# Altium schematic sheet Sheet1.SchDoc
size A; SheetNumber: 5; SheetTotal: 6
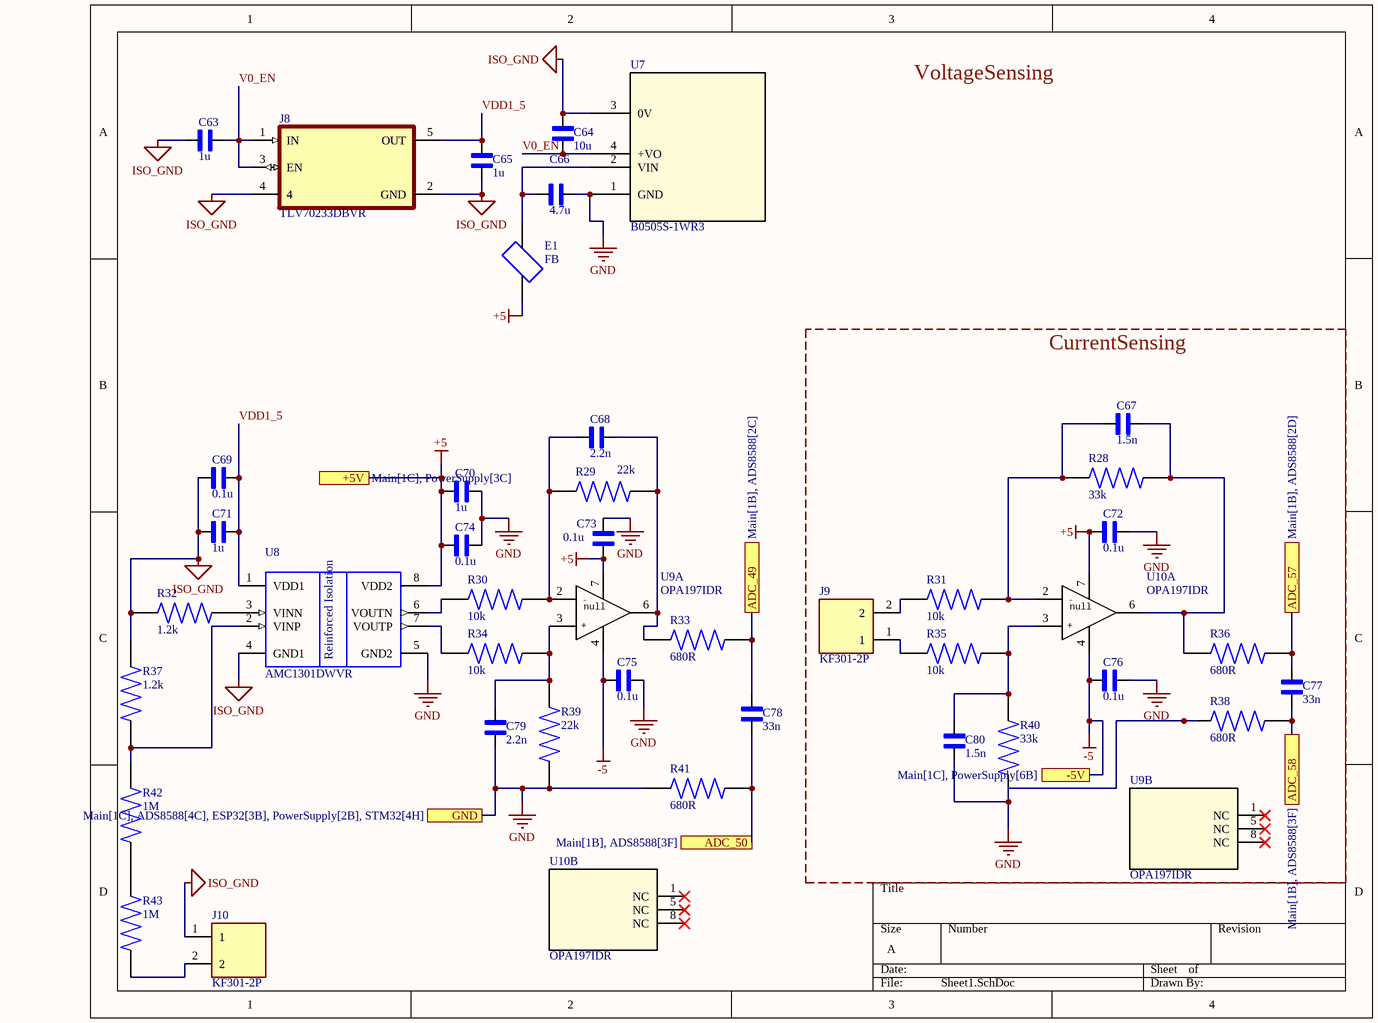
[diagram p0: Sheet1.SchDoc]

## Parts
C63  1u  [0603Capacitor]
C64  10u  [0603Capacitor]
C65  1u  [0603Capacitor]
C66  4.7u  [0603Capacitor]
C67  1.5n  [0603Capacitor]
C68  2.2n  [0603Capacitor]
C69  0.1u  [0603Capacitor]
C70  1u  [0603Capacitor]
C71  1u  [0603Capacitor]
C72  0.1u  [0603Capacitor]
C73  0.1u  [0603Capacitor]
C74  0.1u  [0603Capacitor]
C75  0.1u  [0603Capacitor]
C76  0.1u  [0603Capacitor]
C77  33n  [CAPC1206]
C78  33n  [CAPC1206]
C79  2.2n  [0603Capacitor]
C80  1.5n  [0603Capacitor]
E1  FB  [FB_MI1206K601R-10]
J8  TLV70233DBVR  [TLV70233]
J9  KF301-2P  [HANDSON_KF301-2P]
J10  KF301-2P  [HANDSON_KF301-2P]
R28  33k  [0603Resistor]
R29  22k  [0603Resistor]
R30  10k  [0603Resistor]
R31  10k  [0603Resistor]
R32  1.2k  [0603Resistor]
R33  680R  [0603Resistor]
R34  10k  [0603Resistor]
R35  10k  [0603Resistor]
R36  680R  [0603Resistor]
R37  1.2k  [0603Resistor]
R38  680R  [0603Resistor]
R39  22k  [0603Resistor]
R40  33k  [0603Resistor]
R41  680R  [0603Resistor]
R42  1M  [1M_1206]
R43  1M  [1M_1206]
U7  B0505S-1WR3  [B0505S]
U8  AMC1301DWVR  [AMC1301]
U9  OPA197IDR  [D0008A-MFG]  (parts A,B of 2)
U10  OPA197IDR  [D0008A-MFG]  (parts A,B of 2)

## Blocks framed on the sheet
CurrentSensing: C67 C72 C76 C77 C80 J9 R28 R31 R35 R36 R38 R40 U9 U10

## Ports
+5V (see Main[1C], PowerSupply[3C]), -5V (see Main[1C], PowerSupply[6B]), ADC_49 (see Main[1B], ADS8588[2C]), ADC_50 (see Main[1B], ADS8588[3F]), ADC_57 (see Main[1B], ADS8588[2D]), ADC_58 (see Main[1B], ADS8588[3F]), GND (see Main[1C], ADS8588[4C], ESP32[3B], PowerSupply[2B], STM32[4H])

## Nets
+5: C70.1 C72.1 C73.1 C74.1 E1.1 U8.8(VDD2) U9.7(V+) U10.7(V+) ; port +5V
-5: C75.1 C76.1 U9.4(V-) U10.4(V-) ; port -5V
GND: C66.2 C70.2 C72.2 C73.2 C74.2 C75.2 C76.2 C79.1 C80.1 R38.1 R39.1 R40.1 R41.1 U7.1(GND) U8.5(GND2) ; port GND
ISO_GND: C63.1 C64.2 C65.1 C69.1 C71.1 J8.2(GND) J8.4 J10.1 R32.1 R37.2 U7.3(0V) U8.4(GND1)
ADC_49: C78.2 R33.2 ; port ADC_49
ADC_50: C78.1 R41.2 ; port ADC_50
ADC_57: C77.2 R36.2 ; port ADC_57
ADC_58: C77.1 R38.2 ; port ADC_58
V0_EN: C63.2 C64.1 J8.1(IN) J8.3(EN) U7.4(+VO)
VDD1_5: C65.2 C69.2 C71.2 J8.5(OUT) U8.1(VDD1)
NetC66_1: C66.1 E1.2 U7.2(VIN)
NetC67_1: C67.1 R28.1 R31.2 U10.2(-IN)
NetC67_2: C67.2 R28.2 R36.1 U10.6(OUT)
NetC68_1: C68.1 R29.1 R30.2 U9.2(-IN)
NetC68_2: C68.2 R29.2 R33.1 U9.6(OUT)
NetC79_2: C79.2 R34.2 R39.2 U9.3(+IN)
NetC80_2: C80.2 R35.2 R40.2 U10.3(+IN)
NetJ9_1: J9.1 R35.1
NetJ9_2: J9.2 R31.1
NetJ10_2: J10.2 R43.1
NetR30_1: R30.1 U8.6(VOUTN)
NetR32_2: R32.2 U8.3(VINN)
NetR34_1: R34.1 U8.7(VOUTP)
NetR37_1: R37.1 R42.2 U8.2(VINP)
NetR42_1: R42.1 R43.2

Not connected (* = marked no-connect by the designer): U9 1(NC)* 5(NC)* 8(NC)*; U10 1(NC)* 5(NC)* 8(NC)*

## Notes on the sheet
- VoltageSensing
- (in symbol AMC1301DWVR) Reinforced Isolation
- (in symbol OPA197IDR, part A) -; null; +

## Library data of the parts
C63 C65 C70 C71 = 0603_1u: 1uF,X7R,50V; MF: AVX; MP: 0603YC223KAT2A; SnapEDA_Link: https://www.snapeda.com/parts/0603YC223KAT2A/AVX/view-part/?ref=snap; Package: 1608 AVX; Value: *; Check_prices: https://www.snapeda.com/parts/0603YC223KAT2A/AVX/view-part/?ref=eda
C64 = 0603_10u: 10uF,X7R,50V; MF: AVX; MP: 0603YC223KAT2A; SnapEDA_Link: https://www.snapeda.com/parts/0603YC223KAT2A/AVX/view-part/?ref=snap; Package: 1608 AVX; Value: *; Check_prices: https://www.snapeda.com/parts/0603YC223KAT2A/AVX/view-part/?ref=eda
C66 = 0603_4.7u: 4.7uF,X7R,50V; MF: AVX; MP: 0603YC223KAT2A; SnapEDA_Link: https://www.snapeda.com/parts/0603YC223KAT2A/AVX/view-part/?ref=snap; Package: 1608 AVX; Value: *; Check_prices: https://www.snapeda.com/parts/0603YC223KAT2A/AVX/view-part/?ref=eda
C67 C80 = 0603_1.5nf: 1.5nf_C0G_50V; MF: AVX; MP: 0603YC223KAT2A; SnapEDA_Link: https://www.snapeda.com/parts/0603YC223KAT2A/AVX/view-part/?ref=snap; Package: 1608 AVX; Value: *; Check_prices: https://www.snapeda.com/parts/0603YC223KAT2A/AVX/view-part/?ref=eda
C68 C79 = 0603_2.2n: 2.2nF,C0G,50V; MF: AVX; MP: 0603YC223KAT2A; SnapEDA_Link: https://www.snapeda.com/parts/0603YC223KAT2A/AVX/view-part/?ref=snap; Package: 1608 AVX; Value: *; Check_prices: https://www.snapeda.com/parts/0603YC223KAT2A/AVX/view-part/?ref=eda
C69 C72-C76 = 0603_0.1u: 100nf,X7R,50V; MF: AVX; MP: 0603YC223KAT2A; SnapEDA_Link: https://www.snapeda.com/parts/0603YC223KAT2A/AVX/view-part/?ref=snap; Package: 1608 AVX; Value: *; Check_prices: https://www.snapeda.com/parts/0603YC223KAT2A/AVX/view-part/?ref=eda
C77 C78 = 0603_33n: 33nf_C0G_50V; MF: AVX; MP: 0603YC223KAT2A; SnapEDA_Link: https://www.snapeda.com/parts/0603YC223KAT2A/AVX/view-part/?ref=snap; Package: 1608 AVX; Value: *; Check_prices: https://www.snapeda.com/parts/0603YC223KAT2A/AVX/view-part/?ref=eda
E1 = MI1206K601R-10: 600 Ohms @ 100 MHz 1 Power, Signal Line Ferrite Bead 1206 (3216 Metric) 1.5A 80mOhm; MF: Laird-Signal Integrity; SnapEDA_Link: https://www.snapeda.com/parts/MI1206K601R-10/Laird-Signal+Integrity+Products/view-part/?ref=snap; Package: 1206 Laird; Value: *; MP: MI1206K601R-10; Check_prices: https://www.snapeda.com/parts/MI1206K601R-10/Laird-Signal+Integrity+Products/view-part/?ref=eda
J8 = TLV70233DBVR: 300-mA, high-PSRR, low-IQ, low-dropout voltage regulator with enable; MF: Texas Instruments; SnapEDA_Link: https://www.snapeda.com/parts/TLV70233DBVR/Texas+Instruments/view-part/?ref=snap; Package: SOT-23-5 Texas Instruments; Value: *; MP: TLV70233DBVR; Check_prices: https://www.snapeda.com/parts/TLV70233DBVR/Texas+Instruments/view-part/?ref=eda
J9 J10 = KF301-2P: 2 Pin Terminal Block 5mm Pitch; MF: Handson Technology; SnapEDA_Link: https://www.snapeda.com/parts/KF301-2P/Handson+Technology/view-part/?ref=snap; Package: None; Value: *; MP: KF301-2P; Check_prices: https://www.snapeda.com/parts/KF301-2P/Handson+Technology/view-part/?ref=eda
R28 R40 = 0603_33k_1: 33kOhm; MF: Bourns; MP: CRT0603-FY-1000ELF; Purchase-URL: https://pricing.snapeda.com/search/part/CRT0603-FY-1000ELF/?ref=eda; Value: *; SnapEDA_Link: https://www.snapeda.com/parts/CRT0603-FY-1000ELF/Bourns/view-part/?ref=snap; Package: 1508 Bourns; Check_prices: https://www.snapeda.com/parts/CRT0603-FY-1000ELF/Bourns/view-part/?ref=eda; Digi-Key_Part_Number: 118-CRT0603-FY-1000ELFTR-ND
R29 R39 = 0603_22k: 22kOhm_0.1% to 0.5%; MF: Bourns; MP: CRT0603-FY-1000ELF; Purchase-URL: https://pricing.snapeda.com/search/part/CRT0603-FY-1000ELF/?ref=eda; Value: *; SnapEDA_Link: https://www.snapeda.com/parts/CRT0603-FY-1000ELF/Bourns/view-part/?ref=snap; Package: 1508 Bourns; Check_prices: https://www.snapeda.com/parts/CRT0603-FY-1000ELF/Bourns/view-part/?ref=eda; Digi-Key_Part_Number: 118-CRT0603-FY-1000ELFTR-ND
R30 R31 R34 R35 = 0603_10k: 10kOhm; MF: Bourns; MP: CRT0603-FY-1000ELF; Purchase-URL: https://pricing.snapeda.com/search/part/CRT0603-FY-1000ELF/?ref=eda; Value: *; SnapEDA_Link: https://www.snapeda.com/parts/CRT0603-FY-1000ELF/Bourns/view-part/?ref=snap; Package: 1508 Bourns; Check_prices: https://www.snapeda.com/parts/CRT0603-FY-1000ELF/Bourns/view-part/?ref=eda; Digi-Key_Part_Number: 118-CRT0603-FY-1000ELFTR-ND
R32 R37 = 0603_1.2K: 1.2k (0.1%-0.5%); MF: Bourns; MP: CRT0603-FY-1000ELF; Purchase-URL: https://pricing.snapeda.com/search/part/CRT0603-FY-1000ELF/?ref=eda; Value: *; SnapEDA_Link: https://www.snapeda.com/parts/CRT0603-FY-1000ELF/Bourns/view-part/?ref=snap; Package: 1508 Bourns; Check_prices: https://www.snapeda.com/parts/CRT0603-FY-1000ELF/Bourns/view-part/?ref=eda; Digi-Key_Part_Number: 118-CRT0603-FY-1000ELFTR-ND
R33 R36 R38 R41 = 0603_680Ohm: 680Ohm-0.1%; MF: Bourns; MP: CRT0603-FY-1000ELF; Purchase-URL: https://pricing.snapeda.com/search/part/CRT0603-FY-1000ELF/?ref=eda; Value: *; SnapEDA_Link: https://www.snapeda.com/parts/CRT0603-FY-1000ELF/Bourns/view-part/?ref=snap; Package: 1508 Bourns; Check_prices: https://www.snapeda.com/parts/CRT0603-FY-1000ELF/Bourns/view-part/?ref=eda; Digi-Key_Part_Number: 118-CRT0603-FY-1000ELFTR-ND
R42 R43 = 1206-1M: 1M Ohms Â±1% 0.25W, 1/4W Chip Resistor 1206 (3216 Metric) Moisture Resistant Thick Film; MF: Yageo; MP: RC1206JR-0713RL; SnapEDA_Link: https://www.snapeda.com/parts/RC1206JR-0713RL/Yageo/view-part/?ref=snap; Package: 3116 Yageo; Value: *; Check_prices: https://www.snapeda.com/parts/RC1206JR-0713RL/Yageo/view-part/?ref=eda
U7 = B0505S-1WR3: Description; Manufacturer_Name: MORNSUN; Type: DC DC Converters; Copyright: Copyright (C) 2026 Ultra Librarian. All rights reserved.; Manufacturer_Part_Number: B0505S-1WR3; RefDes: RefDes
U8 = AMC1301DWVR: 250 mV-Input Precision Reinforced Isolated Amplifier for Current Sensing 8-SOIC -40 to 125; MF: Texas Instruments; Check_prices: https://www.snapeda.com/parts/AMC1301DWVR/Texas+Instruments/view-part/?ref=eda; SnapEDA_Link: https://www.snapeda.com/parts/AMC1301DWVR/Texas+Instruments/view-part/?ref=snap; Availability: In Stock; Price: None; Value: *; MP: AMC1301DWVR; Package: SOIC-8 Texas Instruments; Purchase-URL: https://pricing.snapeda.com/search/part/AMC1301DWVR/?ref=eda
U9 U10 = OPA197IDR: Single, 36-V, precision, rail-to-rail input output, low offset voltage op amp 8-SOIC -40 to 125; Manufacturer_Name: Texas Instruments; TYPE: TYPE; RefDes: RefDes; Copyright: Copyright (C) 2026 Ultra Librarian. All rights reserved.; Manufacturer_Part_Number: OPA197IDR